# EAGLE design untitled (EAGLE 9.6.2)
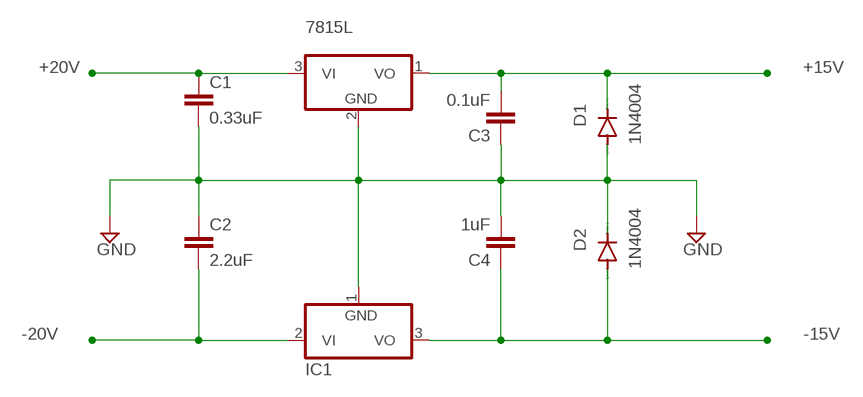
[diagram p0: schematic, sheet 1]

## Parts
C1  0.33uF  C2,5-3  [C2.5-3]
C2  2.2uF  C2,5-3  [C2.5-3]
C3  0.1uF  C2,5-3  [C2.5-3]
C4  1uF  C2,5-3  [C2.5-3]
D1  1N4004  [DO41-10]
D2  1N4004  [DO41-10]
IC1  -15v  7915L  [TO92]
LM7815  7815L  [TO92]

## Nets
+15V: C3.2 D1.C LM7815.1(VO)
+20V: C1.1 LM7815.3(VI)
-15V: C4.1 D2.A IC1.3(VO)
-20V: C2.2 IC1.2(VI)
GND: C1.2 C2.1 C3.1 C4.2 D1.A D2.C IC1.1(GND) LM7815.2(GND)

## Library data of the parts
C1-C4 = capacitor-wima:C: CAPACITOR naming: grid - package width
D1 D2 = diode:1N4004: DIODE general purpose rectifier, 1 A
IC1 = linear:79*: Negative VOLTAGE REGULATOR
LM7815 = linear:78*: Positive VOLTAGE REGULATOR Source: http://cache.national.com/ds/LM/LM78L05.pdf http://www.fairchildsemi.com/ds/LM/LM7805.pdf

## Board
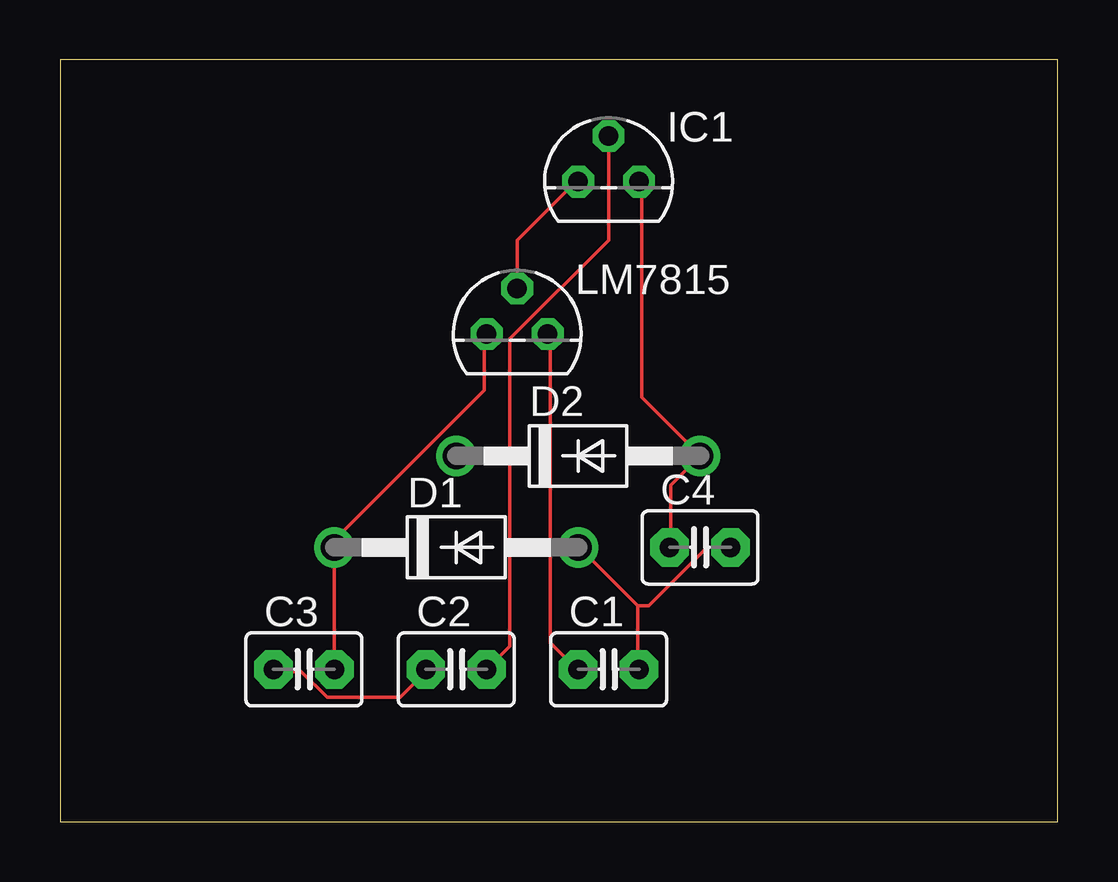
[diagram p1: board, top side]
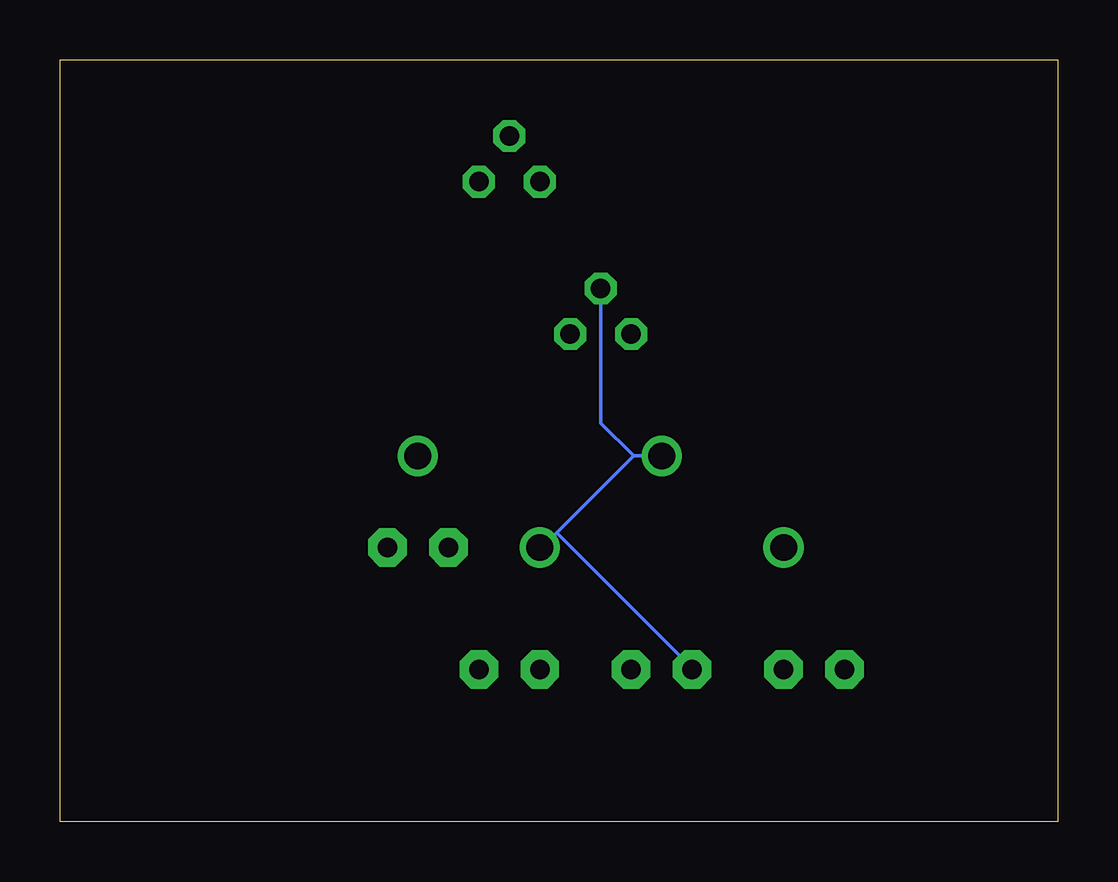
[diagram p2: board, bottom side, seen from below]

Size 41.58 x 31.74 mm. Coordinates in mm from the lower left corner, seen from the top.
Outline: 0,0 41.58,0 41.58,31.74 0,31.74 0,0
Copper layers (1*16): Top 0.035mm / dielectric 1.5mm / Bottom 0.035mm
Design rules "default": minimum track width 6mil, minimum drill 0.35mm, track to track 6mil, track to pad 6mil, pad to pad 6mil, via to via 6mil, smd to smd 6mil, copper to edge 40mil, drill to drill 6mil, minimum pad ring 10mil, minimum via ring 8mil, stop-mask expansion 4mil, vias tented up to drill 0mil, thermal gap 10mil

### Footprints (pad centres in the part's own frame; a part is rotated, then mirrored left to right if it is on the bottom)
C2.5-3 = drill 0.813 pad 1.6 octagon: 1 -1.27,0; 2 1.27,0
DO41-10 = drill 1.118: A 5.08,0; C -5.08,0
TO92 = drill 0.813 octagon: 1 -1.27,0; 2 0,1.905; 3 1.27,0

### Placement (x,y rotation side)
C1  22.86,6.35 0 top
C2  16.51,6.35 0 top
C3  10.16,6.35 0 top
C4  26.67,11.43 0 top
D1  16.51,11.43 0 top
D2  21.59,15.24 0 top
IC1  22.86,26.67 0 top
LM7815  19.05,20.32 0 top

### Tracks (layer width: path | path; a pad name or v marks a point on that pad's centre or on a via)
+15V
  Top 0.152: LM7815.1 17.68,20.27 17.68,17.98 11.43,11.73 D1.C C3.2
+20V
  Top 0.152: LM7815.3 20.42,20.27 20.42,7.47 21.49,6.4 C1.1
-15V
  Top 0.152: IC1.3 24.23,26.67 24.23,17.68 D2.A 25.45,14.02 25.45,11.43 C4.1
-20V
  Top 0.152: IC1.2 22.86,24.23 18.75,20.12 18.75,7.32 C2.2
GND
  Top 0.152: C3.1 8.99,6.25 10.06,6.25 11.12,5.18 14.17,5.18 15.24,6.25 C2.1 | LM7815.2 19.05,24.23 21.49,26.67 IC1.1 | 24.08,8.99 24.08,6.4 C1.2 | 24.08,8.99 21.64,11.43 D1.A | C4.2 26.98,11.43 24.54,8.99 24.08,8.99
  Bottom 0.152: 17.68,15.24 D2.C | 20.88,12.04 21.49,11.43 D1.A | 20.88,12.04 17.68,15.24 | LM7815.2 19.05,16.61 17.68,15.24 | 20.88,12.04 15.24,6.4 C2.1